# Altium project AEVC-bodyBoard.PrjPcb
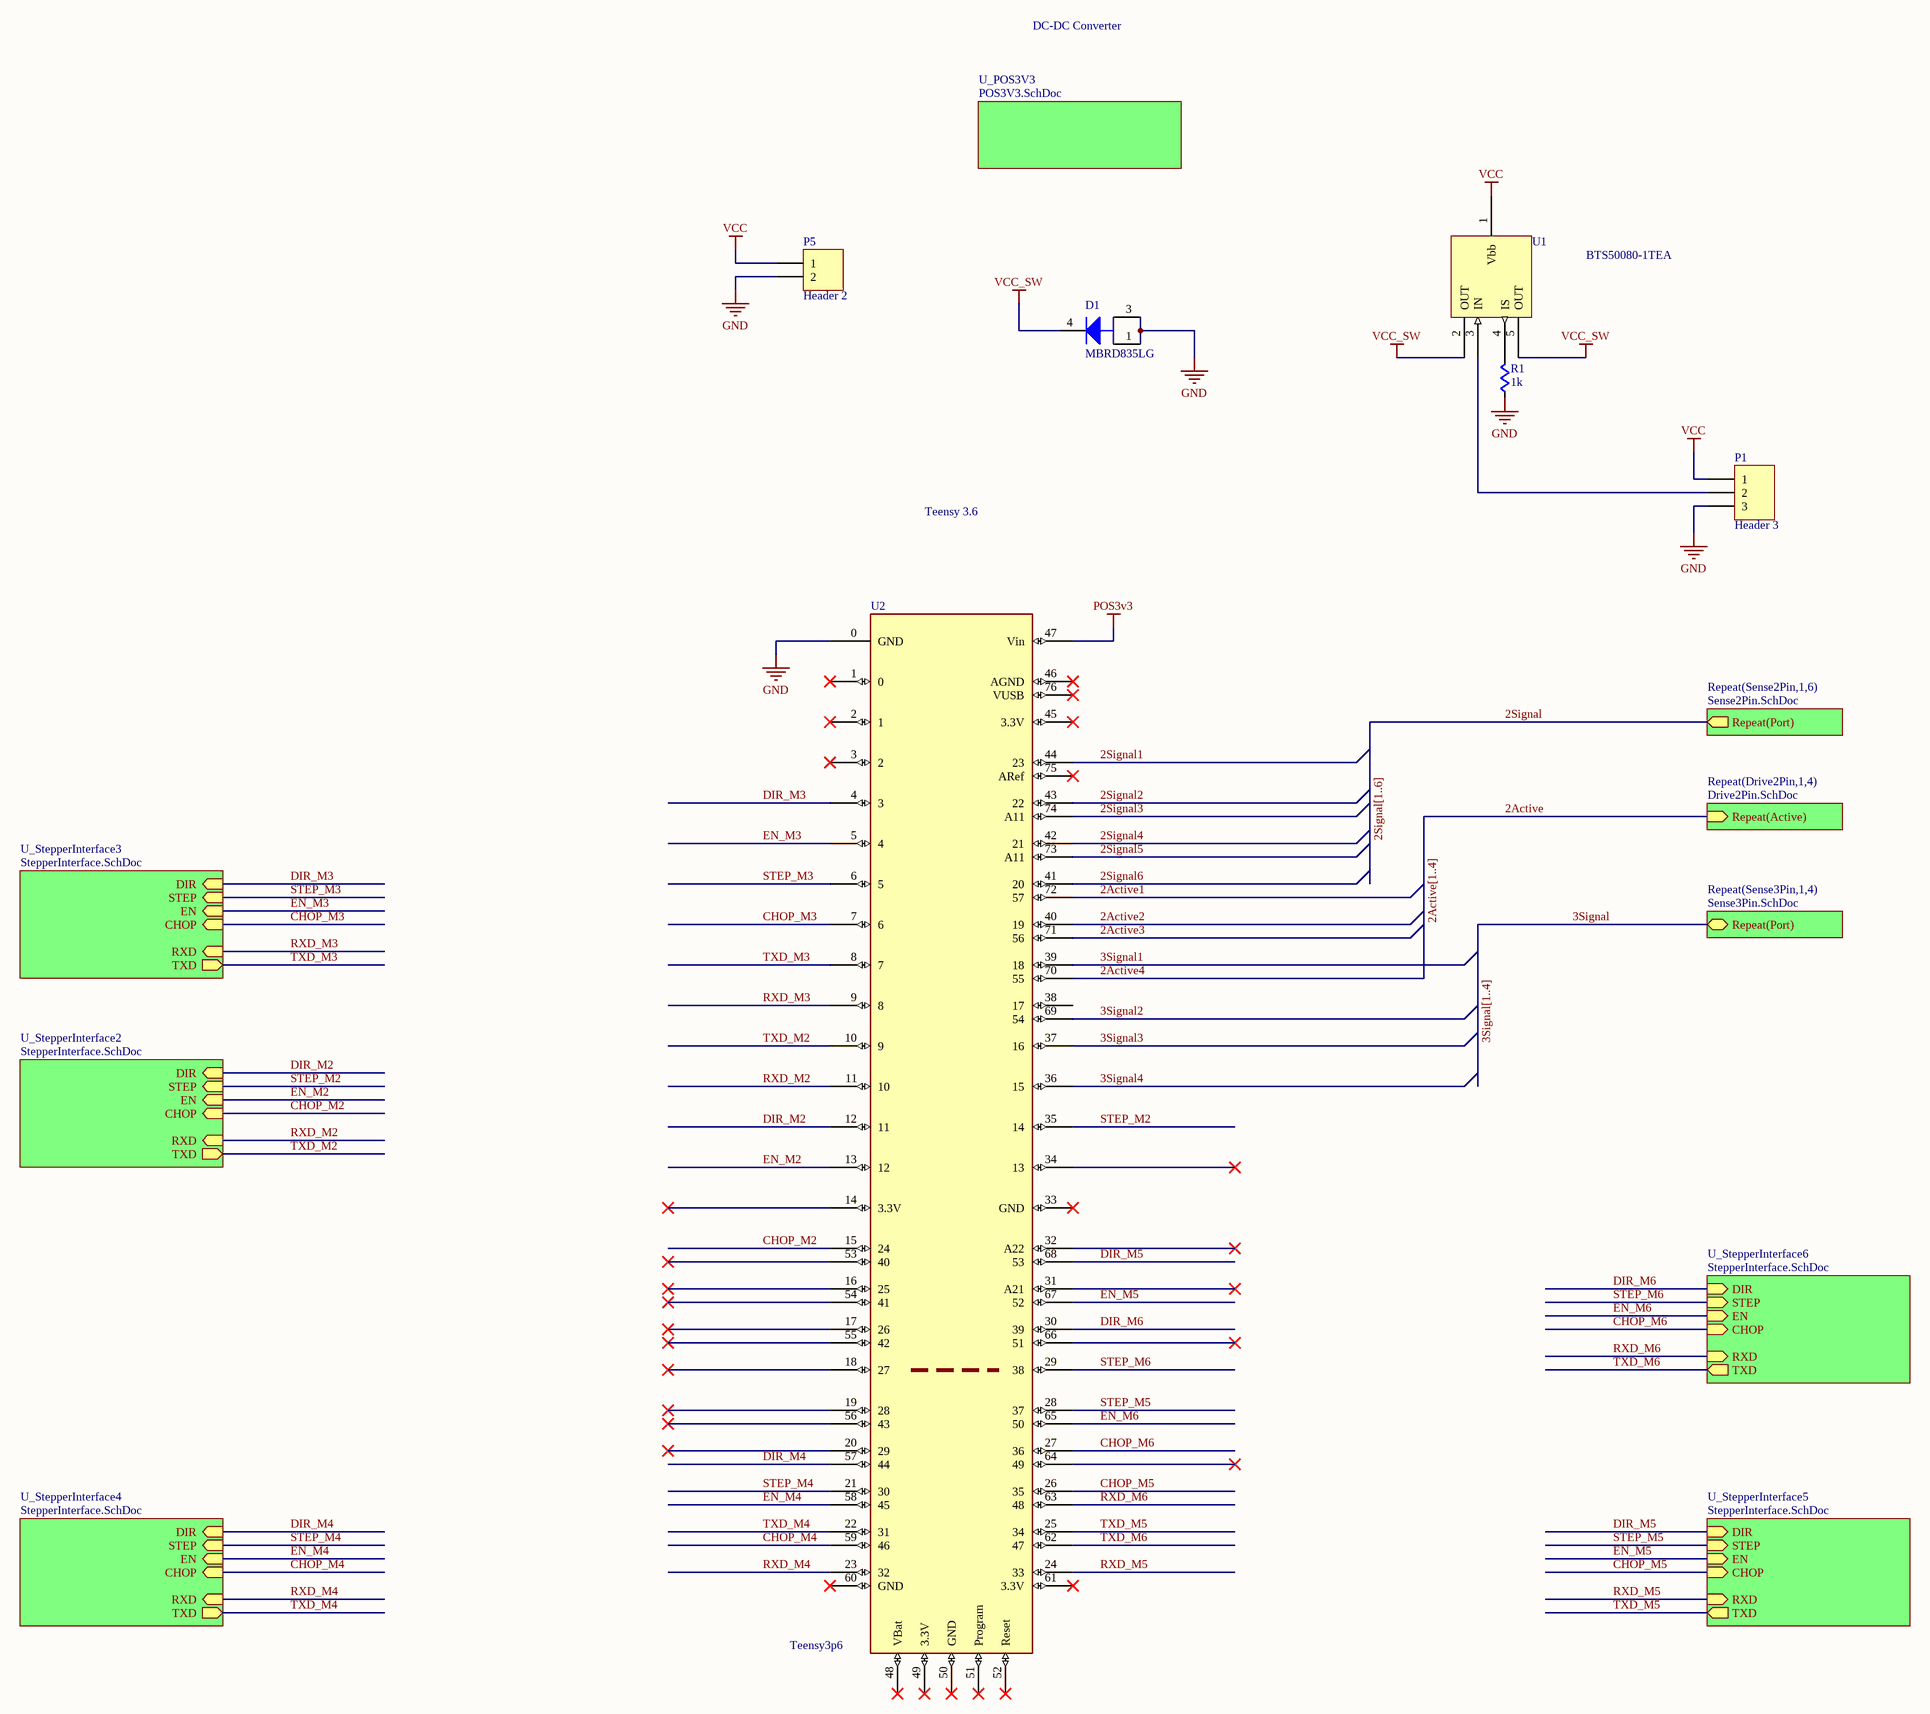
[diagram p0: Main.SchDoc]
7 sheets, 58 parts. Net scope: hierarchical (ports join the sheet entries above them; power ports are global).
Board file: BodyPCB.PcbDoc
Sheets:
  Main.SchDoc
    U_StepperInterface3 = StepperInterface.SchDoc
    U_StepperInterface4 = StepperInterface.SchDoc
    U_StepperInterface5 = StepperInterface.SchDoc
    U_StepperInterface6 = StepperInterface.SchDoc
    U_StepperInterface2 = StepperInterface.SchDoc
    Sense2Pin1 = Sense2Pin.SchDoc
    Sense2Pin2 = Sense2Pin.SchDoc
    Sense2Pin3 = Sense2Pin.SchDoc
    Sense2Pin4 = Sense2Pin.SchDoc
    Sense2Pin5 = Sense2Pin.SchDoc
    Sense2Pin6 = Sense2Pin.SchDoc
    Sense3Pin1 = Sense3Pin.SchDoc
    Sense3Pin2 = Sense3Pin.SchDoc
    Sense3Pin3 = Sense3Pin.SchDoc
    Sense3Pin4 = Sense3Pin.SchDoc
    Drive2Pin1 = Drive2Pin.SchDoc
    Drive2Pin2 = Drive2Pin.SchDoc
    Drive2Pin3 = Drive2Pin.SchDoc
    Drive2Pin4 = Drive2Pin.SchDoc
    U_POS3V3 = POS3V3.SchDoc
      U_LMR14050_mod = LMR14050_mod.SchDoc

## Sheet Main.SchDoc
size C; Revision: A0

### Parts
D1  MBRD835LG  [ONSC-DPAK-3-369C-01_V]
P1  Header 3  [HDR1X3]
P5  Header 2  [HDR1X2]
R1  value 1k  [R0805]  (hidden comment: Res)
U1  BTS50080-1TEA  [BTS50080]
U2  Teensy3p6  [Teensy3p6_full]

### Sub-sheets
Repeat(Drive2Pin,1,4) = Drive2Pin.SchDoc: Repeat(Active) (in)
Repeat(Sense2Pin,1,6) = Sense2Pin.SchDoc: Repeat(Port) (out)
Repeat(Sense3Pin,1,4) = Sense3Pin.SchDoc: Repeat(Port) (bidir)
U_POS3V3 = POS3V3.SchDoc: no entries
U_StepperInterface2 = StepperInterface.SchDoc: DIR (in), STEP (in), EN (in), CHOP (in), RXD (in), TXD (out)
U_StepperInterface3 = StepperInterface.SchDoc: DIR (in), STEP (in), EN (in), CHOP (in), RXD (in), TXD (out)
U_StepperInterface4 = StepperInterface.SchDoc: DIR (in), STEP (in), EN (in), CHOP (in), RXD (in), TXD (out)
U_StepperInterface5 = StepperInterface.SchDoc: DIR (in), STEP (in), EN (in), CHOP (in), RXD (in), TXD (out)
U_StepperInterface6 = StepperInterface.SchDoc: DIR (in), STEP (in), EN (in), CHOP (in), RXD (in), TXD (out)

### Nets
GND: D1.1(A) D1.3(A) P1.3 P5.2 R1.1 U2.0(GND)
POS3v3: U2.47(Vin)  [project net COMM]
VCC: P1.1 P5.1 U1.1(Vbb)
VCC_SW: D1.4(K) U1.2(OUT) U1.5(OUT)  [project net VDD]
2Active: sheet Repeat(Drive2Pin,1,4)/Repeat(Active)
2Active1: U2.72(57)
2Active2: U2.40(19)
2Active3: U2.71(56)
2Active4: U2.70(55)
2Signal: sheet Repeat(Sense2Pin,1,6)/Repeat(Port)
2Signal1: U2.44(23)
2Signal2: U2.43(22)
2Signal3: U2.74(A11)
2Signal4: U2.42(21)
2Signal5: U2.73(A11)
2Signal6: U2.41(20)
3Signal: sheet Repeat(Sense3Pin,1,4)/Repeat(Port)
3Signal1: U2.39(18)
3Signal2: U2.69(54)
3Signal3: U2.37(16)
3Signal4: U2.36(15)
CHOP_M2: U2.15(24) ; sheet U_StepperInterface2/CHOP  [project net CHOP]
CHOP_M3: U2.7(6) ; sheet U_StepperInterface3/CHOP  [project net CHOP]
CHOP_M4: U2.59(46) ; sheet U_StepperInterface4/CHOP  [project net CHOP]
CHOP_M5: U2.26(35) ; sheet U_StepperInterface5/CHOP  [project net CHOP]
CHOP_M6: U2.27(36) ; sheet U_StepperInterface6/CHOP  [project net CHOP]
DIR_M2: U2.12(11) ; sheet U_StepperInterface2/DIR  [project net DIR]
DIR_M3: U2.4(3) ; sheet U_StepperInterface3/DIR  [project net DIR]
DIR_M4: U2.57(44) ; sheet U_StepperInterface4/DIR  [project net DIR]
DIR_M5: U2.68(53) ; sheet U_StepperInterface5/DIR  [project net DIR]
DIR_M6: U2.30(39) ; sheet U_StepperInterface6/DIR  [project net DIR]
EN_M2: U2.13(12) ; sheet U_StepperInterface2/EN  [project net EN]
EN_M3: U2.5(4) ; sheet U_StepperInterface3/EN  [project net EN]
EN_M4: U2.58(45) ; sheet U_StepperInterface4/EN  [project net EN]
EN_M5: U2.67(52) ; sheet U_StepperInterface5/EN  [project net EN]
EN_M6: U2.65(50) ; sheet U_StepperInterface6/EN  [project net EN]
RXD_M2: U2.11(10) ; sheet U_StepperInterface2/RXD  [project net RXD]
RXD_M3: U2.9(8) ; sheet U_StepperInterface3/RXD  [project net RXD]
RXD_M4: U2.23(32) ; sheet U_StepperInterface4/RXD  [project net RXD]
RXD_M5: U2.24(33) ; sheet U_StepperInterface5/RXD  [project net RXD]
RXD_M6: U2.63(48) ; sheet U_StepperInterface6/RXD  [project net RXD]
STEP_M2: U2.35(14) ; sheet U_StepperInterface2/STEP  [project net STEP]
STEP_M3: U2.6(5) ; sheet U_StepperInterface3/STEP  [project net STEP]
STEP_M4: U2.21(30) ; sheet U_StepperInterface4/STEP  [project net STEP]
STEP_M5: U2.28(37) ; sheet U_StepperInterface5/STEP  [project net STEP]
STEP_M6: U2.29(38) ; sheet U_StepperInterface6/STEP  [project net STEP]
TXD_M2: U2.10(9) ; sheet U_StepperInterface2/TXD  [project net TXD]
TXD_M3: U2.8(7) ; sheet U_StepperInterface3/TXD  [project net TXD]
TXD_M4: U2.22(31) ; sheet U_StepperInterface4/TXD  [project net TXD]
TXD_M5: U2.25(34) ; sheet U_StepperInterface5/TXD  [project net TXD]
TXD_M6: U2.62(47) ; sheet U_StepperInterface6/TXD  [project net TXD]
NetP1_2: P1.2 U1.3(IN)
NetR1_2: R1.2 U1.4(IS)

Not connected (* = marked no-connect by the designer): U2 1(0)* 2(1)* 3(2)* 14(3.3V)* 16(25)* 17(26)* 18(27)* 19(28)* 20(29)* 31(A21)* 32(A22)* 33(GND)* 34(13)* 38(17) 45(3.3V)* 46(AGND)* 48(VBat)* 49(3.3V)* 50(GND)* 51(Program)* 52(Reset)* 53(40)* 54(41)* 55(42)* 56(43)* 60(GND)* 61(3.3V)* 64(49)* 66(51)* 75(ARef)* 76(VUSB)*

### Buses and harness runs
bus 2Active[1..4]
bus 2Signal[1..6]
bus 3Signal[1..4]

### Notes on the sheet
- DC-DC Converter
- Teensy 3.6

### Library data of the parts
D1 = CMP-1055-00169-1: SWITCHMODE(TM) Power Rectifier, 3-Pin DPAK, Pb-Free, Tube; Manufacturer: On Semiconductor; IFSM Max (A): 75; Configuration: Single; RoHS: TRUE; ComponentLink1Description: Manufacturer URL; PackageDescription: 3-Pin Flange Mount, Body 6.54 x 6.095 mm, Pitch 2.29 mm; Packing: Tube; ComponentLink2URL: http://www.onsemi.cn/pub_link/Collateral/MBRD835L-D.PDF; DatasheetVersion: Rev. 11; PackageVersion: Rev. E, 02/2014; ComponentLink3URL: http://www.onsemi.cn/pub_link/Collateral/369C.PDF; ComponentLink1URL: http://www.onsemi.com/; PackageReference: DPAK-3-369C-01; ComponentLink2Description: Datasheet; Mounting Technology: Surface Mount; ComponentLink3Description: Package Specification; PartNumber: MBRD835LG
P1 = Header 3: Header, 3-Pin; LatestRevisionDate: 17-Jul-2002; LatestRevisionNote: Re-released for DXP Platform.; Publisher: Altium Limited
P5 = Header 2: Header, 2-Pin; LatestRevisionDate: 17-Jul-2002; LatestRevisionNote: Re-released for DXP Platform.; Publisher: Altium Limited
R1 = Res: resistor
U1 = BTS50080-1TEA: Smart High-Side Power Switch

## Sheet StepperInterface.SchDoc
size A
Used 5 times, as channels U_StepperInterface3, U_StepperInterface4, U_StepperInterface5, U_StepperInterface6, U_StepperInterface2. Parts and nets are listed once, with the designators drawn on the sheet.
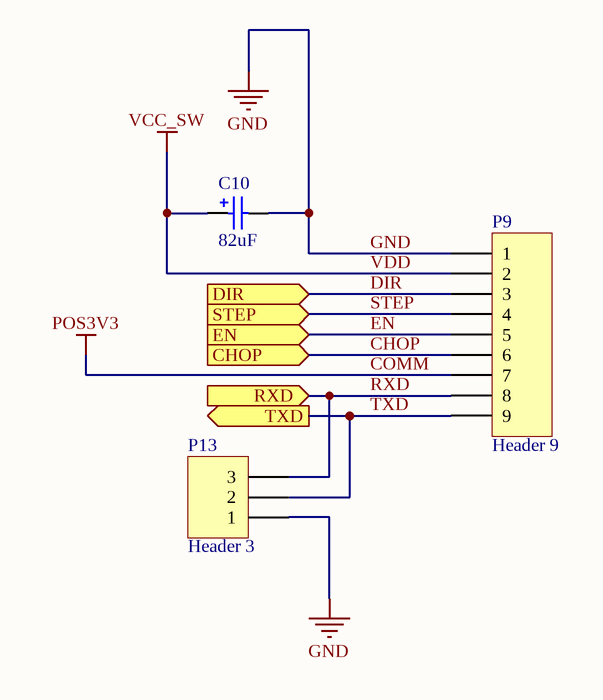
[diagram p1: StepperInterface.SchDoc]

### Parts
C10  value 82uF  [CAP_EEFK_D8]  (hidden comment: EEEFK1V680XP)
P9  Header 9  [HDR1X9]
P13  Header 3  [HDR1X3]

### Ports
CHOP (in), DIR (in), EN (in), RXD (in), STEP (in), TXD (out)

### Nets
COMM: P9.7  [also labelled POS3V3]
GND: C10.2 P9.1 P13.1
VDD: C10.1 P9.2  [also labelled VCC_SW]
CHOP: P9.6 ; port CHOP
DIR: P9.3 ; port DIR
EN: P9.5 ; port EN
RXD: P9.8 P13.3 ; port RXD
STEP: P9.4 ; port STEP
TXD: P9.9 P13.2 ; port TXD

### Channels
U_StepperInterface3: designators C10=C3 P9=P8 P13=P4; ports CHOP=CHOP DIR=DIR EN=EN RXD=RXD STEP=STEP TXD=TXD
U_StepperInterface4: designators C10=C1 P9=P6 P13=P2; ports CHOP=CHOP DIR=DIR EN=EN RXD=RXD STEP=STEP TXD=TXD
U_StepperInterface5: designators C10=C14 P9=P21 P13=P23; ports CHOP=CHOP DIR=DIR EN=EN RXD=RXD STEP=STEP TXD=TXD
U_StepperInterface6: ports CHOP=CHOP DIR=DIR EN=EN RXD=RXD STEP=STEP TXD=TXD
U_StepperInterface2: designators C10=C2 P9=P7 P13=P3; ports CHOP=CHOP DIR=DIR EN=EN RXD=RXD STEP=STEP TXD=TXD

### Library data of the parts
C10 = EEEFK1V680XP: Polarized Capacitor (Surface Mount); Vendor: Panasonic; Built_By: EMA_UL_Team; C: Copyright (C) 2015 Accelerated Designs. All rights reserved; Manufacturer_Part_Number: EEEFK1V680XP; Supplier 1: Digi-Key; Supplier Part Number 1: P18960DKR-ND
P9 = Header 9: Header, 9-Pin; LatestRevisionDate: 17-Jul-2002; LatestRevisionNote: Re-released for DXP Platform.; Publisher: Altium Limited
P13 = Header 3: Header, 3-Pin; LatestRevisionDate: 17-Jul-2002; LatestRevisionNote: Re-released for DXP Platform.; Publisher: Altium Limited

## Sheet Sense2Pin.SchDoc
size B
Used 6 times, as channels Sense2Pin1, Sense2Pin2, Sense2Pin3, Sense2Pin4, Sense2Pin5, Sense2Pin6. Parts and nets are listed once, with the designators drawn on the sheet.
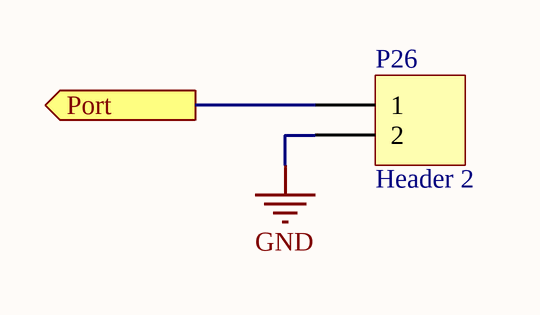
[diagram p2: Sense2Pin.SchDoc]

### Parts
P26  Header 2  [HDR1X2]

### Ports
Port (out)

### Nets
GND: P26.2
Port: P26.1 ; port Port

### Channels
Sense2Pin1: designators P26=P12; ports Port=2Signal1
Sense2Pin2: designators P26=P17; ports Port=2Signal2
Sense2Pin3: designators P26=P14; ports Port=2Signal3
Sense2Pin4: designators P26=P22; ports Port=2Signal4
Sense2Pin5: designators P26=P18; ports Port=2Signal5
Sense2Pin6: ports Port=2Signal6

### Library data of the parts
P26 = Header 2: Header, 2-Pin; LatestRevisionDate: 17-Jul-2002; LatestRevisionNote: Re-released for DXP Platform.; Publisher: Altium Limited

## Sheet Sense3Pin.SchDoc
size B
Used 4 times, as channels Sense3Pin1, Sense3Pin2, Sense3Pin3, Sense3Pin4. Parts and nets are listed once, with the designators drawn on the sheet.
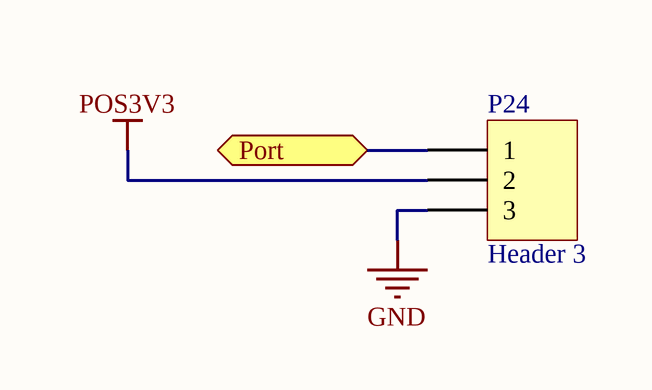
[diagram p3: Sense3Pin.SchDoc]

### Parts
P24  Header 3  [HDR1X3]

### Ports
Port (bidir)

### Nets
GND: P24.3
POS3V3: P24.2
Port: P24.1 ; port Port

### Channels
Sense3Pin1: designators P24=P10; ports Port=3Signal1
Sense3Pin2: designators P24=P15; ports Port=3Signal2
Sense3Pin3: designators P24=P19; ports Port=3Signal3
Sense3Pin4: ports Port=3Signal4

### Library data of the parts
P24 = Header 3: Header, 3-Pin; LatestRevisionDate: 17-Jul-2002; LatestRevisionNote: Re-released for DXP Platform.; Publisher: Altium Limited

## Sheet Drive2Pin.SchDoc
size B
Used 4 times, as channels Drive2Pin1, Drive2Pin2, Drive2Pin3, Drive2Pin4. Parts and nets are listed once, with the designators drawn on the sheet.
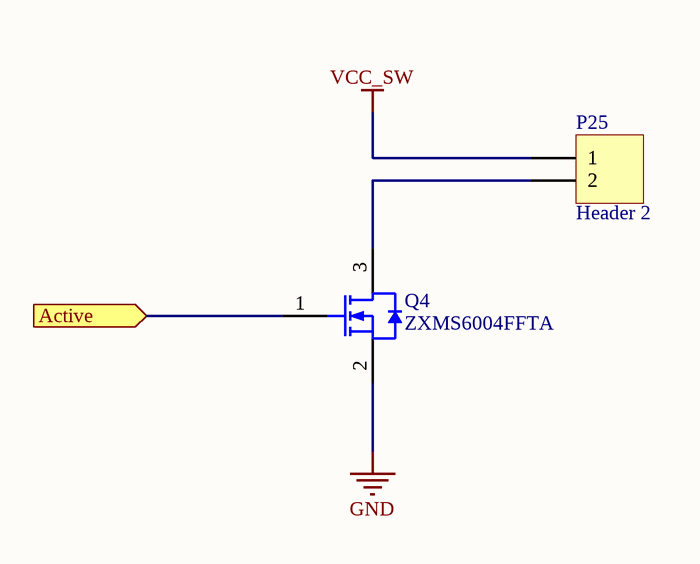
[diagram p4: Drive2Pin.SchDoc]

### Parts
P25  Header 2  [HDR1X2]
Q4  ZXMS6004FFTA  [DIOD-SOT23F-3_V]

### Ports
Active (in)

### Nets
GND: Q4.2(S)
VCC_SW: P25.1
Active: Q4.1(G) ; port Active
NetP25_2: P25.2 Q4.3(D)

### Channels
Drive2Pin1: designators P25=P11 Q4=Q1; ports Active=2Active1
Drive2Pin2: designators P25=P16 Q4=Q2; ports Active=2Active2
Drive2Pin3: designators P25=P20 Q4=Q3; ports Active=2Active3
Drive2Pin4: ports Active=2Active4

### Library data of the parts
P25 = Header 2: Header, 2-Pin; LatestRevisionDate: 17-Jul-2002; LatestRevisionNote: Re-released for DXP Platform.; Publisher: Altium Limited
Q4 = CMP-2000-07435-1: N-Channel Self Protected Enhancement Mode Intellifet(TM) MOSFET, 60 V, 1.3 A, -40 to 150 degC, 3-Pin SOT23, RoHS, Tape and Reel; Manufacturer: Diodes Inc; Voltage - Load: 60V(Max); Current - Output (Max): 1.3A; Featured Product: ZXMS6004FF60VN-ChannelMOSFET; Product Training Modules: IntelliFET's; Rds On (Typ): 350mOhm; Input Type: Non-Inverting; Interface: On/Off; Number of Outputs: 1; Ratio - Input: Output:1:1; Output Configuration: LowSide; Voltage - Supply (Vcc/Vdd): 3.3V,5V; PCN Design/Specification: PartMarkingUpdate25/Sep/2015; Switch Type: GeneralPurpose; Fault Protection: CurrentLimiting(Fixed),OverTemperature,OverVoltage; Other Names: ZXMS6004FFTR; Category: IntegratedCircuits(ICs); Operating Temperature: -40°C~150°C(TJ); Features: AutoRestart; Manufacturer URL: http://www.diodes.com/; Datasheet URL: https://datasheet.ciiva.com/15109/getdatasheetpartid-411522-15109086.pdf; Package Reference: SOT23F-3; Family: PMIC-PowerDistributionSwitches,LoadDrivers; Package Description: 3-Pin Small Outline Transistor Flat Lead, Body 2.9 x 1.6 mm, Pitch 0.95 mm; Output Type: N-Channel; Supplier Device Package: SOT-23F; RoHS Information: RoHSCertofCompliance; Package / Case: SOT-23-3FlatLeads; Packaging: Tape&Reel(TR); Datasheet Version: Rev. 6-2, 10/2014; Mounting Technology: SurfaceMount; Series: Automotive,AEC-Q101,INTELLIFET®; Online Catalog: GeneralPurpose; Standard Package: 3,000

## Sheet POS3V3.SchDoc
size B
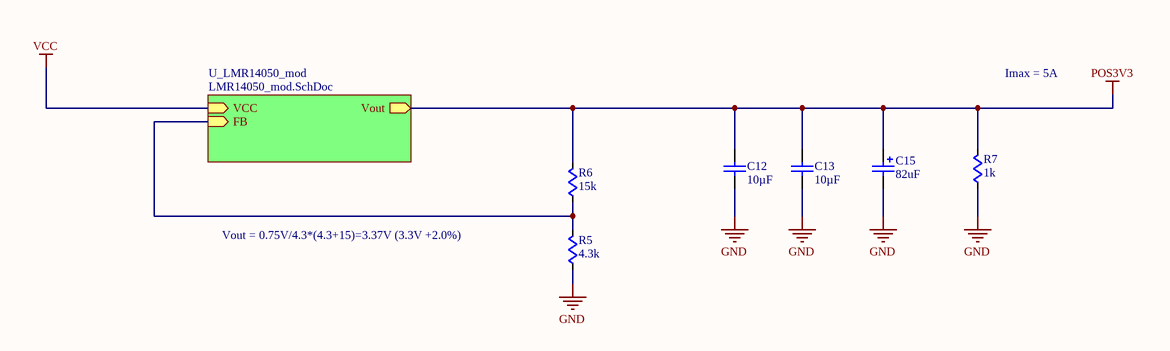
[diagram p5: POS3V3.SchDoc]

### Parts
C12  value 10µF  [C0805]  (hidden comment: Cap)
C13  value 10µF  [C0805]  (hidden comment: Cap)
C15  value 82uF  [CAP_EEFK_D8]  (hidden comment: EEEFK1V680XP)
R5  value 4.3k  [R0805]  (hidden comment: Res)
R6  value 15k  [R0805]  (hidden comment: Res)
R7  value 1k  [R0805]  (hidden comment: Res)

### Sub-sheets
U_LMR14050_mod = LMR14050_mod.SchDoc: VCC (in), FB (in), Vout (out)

### Nets
GND: C12.1 C13.1 C15.2 R5.1 R7.1
POS3V3: C12.2 C13.2 C15.1 R6.2 R7.2 ; sheet U_LMR14050_mod/Vout  [project net COMM]
NetR5_2: R5.2 R6.1 ; sheet U_LMR14050_mod/FB

### Notes on the sheet
- Imax = 5A
- Vout = 0.75V/4.3*(4.3+15)=3.37V (3.3V +2.0%)

### Library data of the parts
C12 C13 = Cap: capacitor
C15 = EEEFK1V680XP: as C10 on sheet StepperInterface; Manufacturer_Part_Number: EEEFK1V680XP; Supplier 1: Digi-Key; Supplier Part Number 1: P18960DKR-ND
R5-R7 = Res: resistor

## Sheet LMR14050_mod.SchDoc
size B
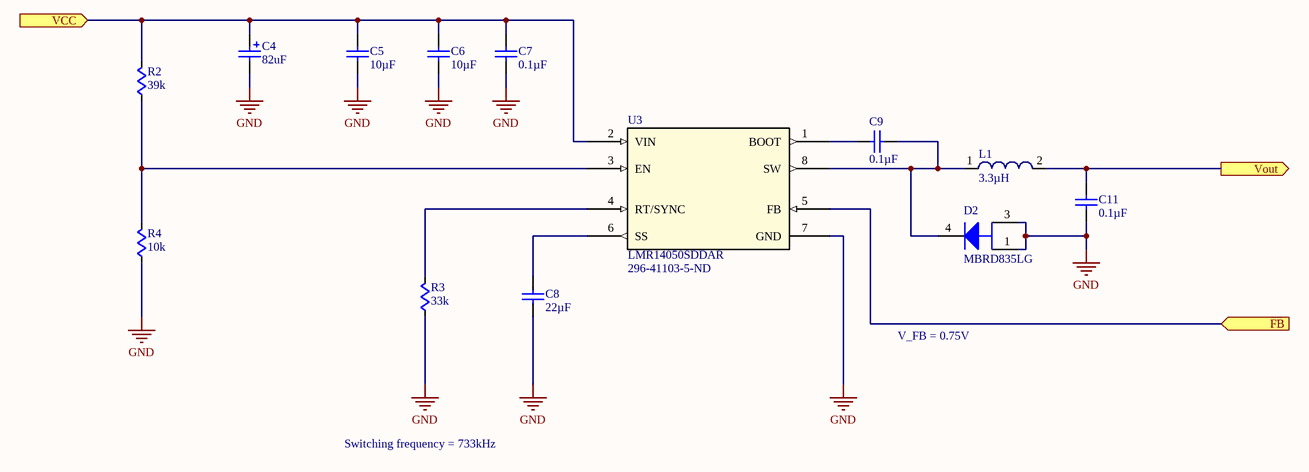
[diagram p6: LMR14050_mod.SchDoc]

### Parts
C4  value 82uF  [CAP_EEFK_D8]  (hidden comment: EEEFK1V680XP)
C5  value 10µF  [C0805]  (hidden comment: Cap)
C6  value 10µF  [C0805]  (hidden comment: Cap)
C7  value 0.1µF  [C0805]  (hidden comment: Cap)
C8  value 22µF  [C0805]  (hidden comment: Cap)
C9  value 0.1µF  [C0805]  (hidden comment: Cap)
C11  value 0.1µF  [C0805]  (hidden comment: Cap)
D2  MBRD835LG  [ONSC-DPAK-3-369C-01_V]
L1  value 3.3µH  [IHLP-2525C7]  (hidden comment: Ind)
R2  value 39k  [R0805]  (hidden comment: Res)
R3  value 33k  [R0805]  (hidden comment: Res)
R4  value 10k  [R0805]  (hidden comment: Res)
U3  LMR14050SDDAR  Supplier Part Number 1: 296-41103-5-ND  [DDA8]

### Ports
FB (in), VCC (in), Vout (out)

### Nets
COMM: C11.2 L1.2 ; port Vout
GND: C4.2 C5.1 C6.1 C7.1 C8.1 C11.1 D2.1(A) D2.3(A) R3.1 R4.1 U3.7(GND)
VCC: C4.1 C5.2 C6.2 C7.2 R2.2 U3.2(VIN) ; port VCC
NetC8_2: C8.2 U3.6(SS)
NetC9_1: C9.1 D2.4(K) L1.1 U3.8(SW)
NetC9_2: C9.2 U3.1(BOOT)
NetR2_1: R2.1 R4.2 U3.3(EN)
NetR3_2: R3.2 U3.4(RT/SYNC)
NetR5_2: U3.5(FB) ; port FB

### Notes on the sheet
- V_FB = 0.75V
- Switching frequency = 733kHz

### Library data of the parts
C4 = EEEFK1V680XP: as C10 on sheet StepperInterface; Manufacturer_Part_Number: EEEFK1V680XP; Supplier 1: Digi-Key; Supplier Part Number 1: P18960DKR-ND
C5-C9 C11 = Cap: capacitor
D2 = CMP-1055-00169-1: as D1 on sheet Main; RoHS: TRUE; ComponentLink1Description: Manufacturer URL; PackageDescription: 3-Pin Flange Mount, Body 6.54 x 6.095 mm, Pitch 2.29 mm; Packing: Tube; ComponentLink2URL: http://www.onsemi.cn/pub_link/Collateral/MBRD835L-D.PDF; DatasheetVersion: Rev. 11; PackageVersion: Rev. E, 02/2014; ComponentLink3URL: http://www.onsemi.cn/pub_link/Collateral/369C.PDF; ComponentLink1URL: http://www.onsemi.com/; PackageReference: DPAK-3-369C-01; ComponentLink2Description: Datasheet; Mounting Technology: Surface Mount; ComponentLink3Description: Package Specification; PartNumber: MBRD835LG
L1 = Ind: Inductor; Supplier 1: Digi-Key; Supplier Part Number 1: 541-2580-1-ND
R2-R4 = Res: resistor
U3 = LMR14050SDDAR: dc-dc converter; Vendor: Texas Instruments; Built_By: EMA_UL_Team; C: Copyright (C) 2016 Accelerated Designs. All rights reserved; Manufacturer_Part_Number: LMR14050SDDAR; Value: Value; Type: Type; RefDes: RefDes; Supplier 1: Digi-Key

## Nets that join several sheets
COMM: Main (U2.47), U_StepperInterface3 (P8.7), U_StepperInterface4 (P6.7), U_StepperInterface5 (P21.7), U_StepperInterface6 (P9.7), U_StepperInterface2 (P7.7), Sense3Pin1 (P10.2), Sense3Pin2 (P15.2), Sense3Pin3 (P19.2), Sense3Pin4 (P24.2), POS3V3 (5 pins), LMR14050_mod (C11.2 L1.2)
GND: Main (6 pins), U_StepperInterface3 (C3.2 P4.1 P8.1), U_StepperInterface4 (C1.2 P2.1 P6.1), U_StepperInterface5 (C14.2 P21.1 P23.1), U_StepperInterface6 (C10.2 P9.1 P13.1), U_StepperInterface2 (C2.2 P3.1 P7.1), Sense2Pin1 (P12.2), Sense2Pin2 (P17.2), Sense2Pin3 (P14.2), Sense2Pin4 (P22.2), Sense2Pin5 (P18.2), Sense2Pin6 (P26.2), Sense3Pin1 (P10.3), Sense3Pin2 (P15.3), Sense3Pin3 (P19.3), Sense3Pin4 (P24.3), Drive2Pin1 (Q1.2), Drive2Pin2 (Q2.2), Drive2Pin3 (Q3.2), Drive2Pin4 (Q4.2), POS3V3 (5 pins), LMR14050_mod (11 pins)
VCC: Main (P1.1 P5.1 U1.1), LMR14050_mod (6 pins)
VDD: Main (D1.4 U1.2 U1.5), U_StepperInterface3 (C3.1 P8.2), U_StepperInterface4 (C1.1 P6.2), U_StepperInterface5 (C14.1 P21.2), U_StepperInterface6 (C10.1 P9.2), U_StepperInterface2 (C2.1 P7.2), Drive2Pin1 (P11.1), Drive2Pin2 (P16.1), Drive2Pin3 (P20.1), Drive2Pin4 (P25.1)
2Active1: Main (U2.72), Drive2Pin1 (Q1.1)
2Active2: Main (U2.40), Drive2Pin2 (Q2.1)
2Active3: Main (U2.71), Drive2Pin3 (Q3.1)
2Active4: Main (U2.70), Drive2Pin4 (Q4.1)
2Signal1: Main (U2.44), Sense2Pin1 (P12.1)
2Signal2: Main (U2.43), Sense2Pin2 (P17.1)
2Signal3: Main (U2.74), Sense2Pin3 (P14.1)
2Signal4: Main (U2.42), Sense2Pin4 (P22.1)
2Signal5: Main (U2.73), Sense2Pin5 (P18.1)
2Signal6: Main (U2.41), Sense2Pin6 (P26.1)
3Signal1: Main (U2.39), Sense3Pin1 (P10.1)
3Signal2: Main (U2.69), Sense3Pin2 (P15.1)
3Signal3: Main (U2.37), Sense3Pin3 (P19.1)
3Signal4: Main (U2.36), Sense3Pin4 (P24.1)
CHOP: Main (U2.7), U_StepperInterface3 (P8.6)
CHOP: Main (U2.15), U_StepperInterface2 (P7.6)
CHOP: Main (U2.26), U_StepperInterface5 (P21.6)
CHOP: Main (U2.27), U_StepperInterface6 (P9.6)
CHOP: Main (U2.59), U_StepperInterface4 (P6.6)
DIR: Main (U2.4), U_StepperInterface3 (P8.3)
DIR: Main (U2.12), U_StepperInterface2 (P7.3)
DIR: Main (U2.30), U_StepperInterface6 (P9.3)
DIR: Main (U2.57), U_StepperInterface4 (P6.3)
DIR: Main (U2.68), U_StepperInterface5 (P21.3)
EN: Main (U2.5), U_StepperInterface3 (P8.5)
EN: Main (U2.13), U_StepperInterface2 (P7.5)
EN: Main (U2.58), U_StepperInterface4 (P6.5)
EN: Main (U2.65), U_StepperInterface6 (P9.5)
EN: Main (U2.67), U_StepperInterface5 (P21.5)
NetR5_2: POS3V3 (R5.2 R6.1), LMR14050_mod (U3.5)
RXD: Main (U2.9), U_StepperInterface3 (P4.3 P8.8)
RXD: Main (U2.11), U_StepperInterface2 (P3.3 P7.8)
RXD: Main (U2.23), U_StepperInterface4 (P2.3 P6.8)
RXD: Main (U2.24), U_StepperInterface5 (P21.8 P23.3)
RXD: Main (U2.63), U_StepperInterface6 (P9.8 P13.3)
STEP: Main (U2.6), U_StepperInterface3 (P8.4)
STEP: Main (U2.21), U_StepperInterface4 (P6.4)
STEP: Main (U2.28), U_StepperInterface5 (P21.4)
STEP: Main (U2.29), U_StepperInterface6 (P9.4)
STEP: Main (U2.35), U_StepperInterface2 (P7.4)
TXD: Main (U2.8), U_StepperInterface3 (P4.2 P8.9)
TXD: Main (U2.10), U_StepperInterface2 (P3.2 P7.9)
TXD: Main (U2.22), U_StepperInterface4 (P2.2 P6.9)
TXD: Main (U2.25), U_StepperInterface5 (P21.9 P23.2)
TXD: Main (U2.62), U_StepperInterface6 (P9.9 P13.2)